# EAGLE design R650C (EAGLE 6.6.0)
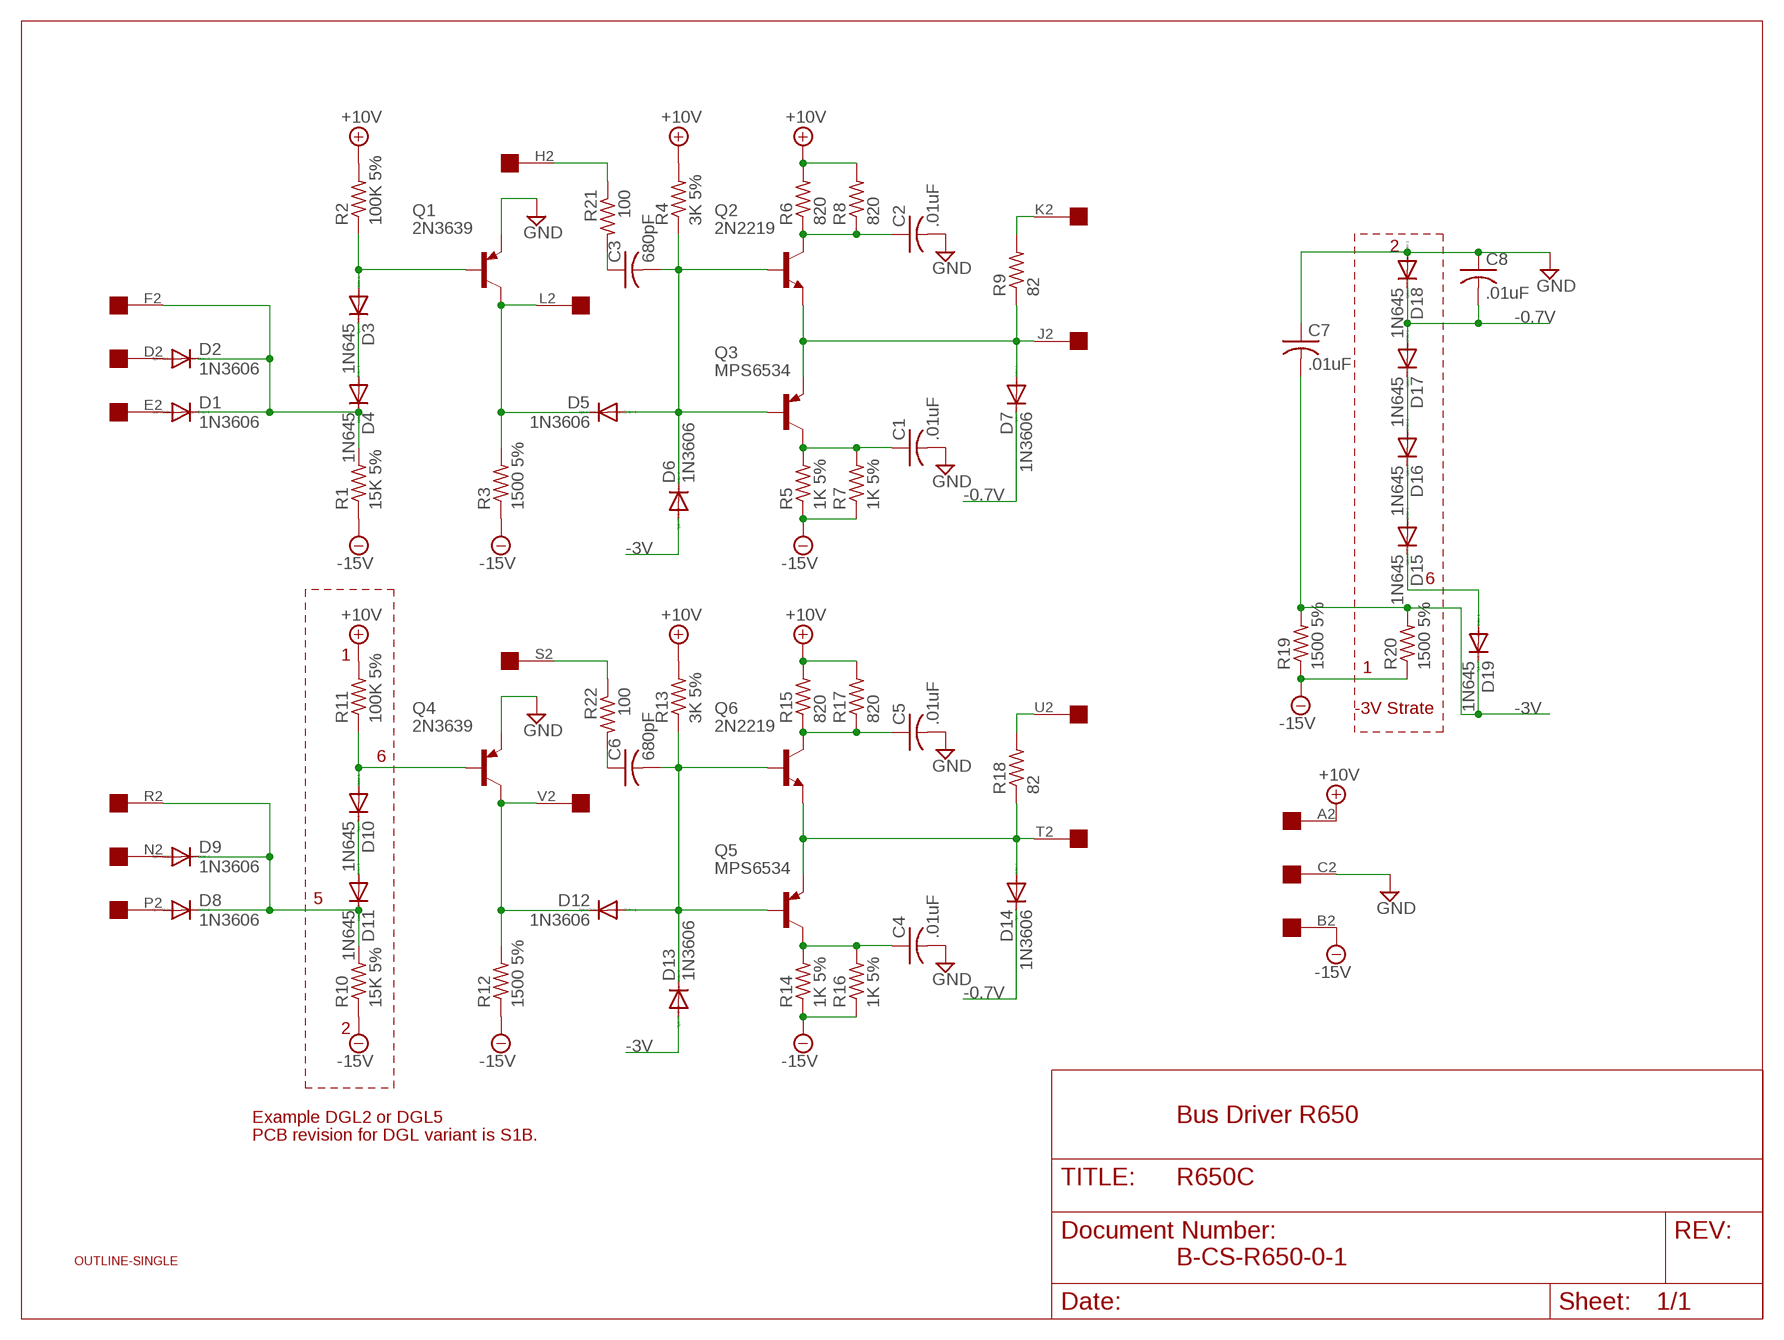
[diagram p0: schematic, sheet 1]

## Parts
C1  .01uF  C-US050-025X075  [C050-025X075]
C2  .01uF  C-US050-025X075  [C050-025X075]
C3  680pF  C-US050-025X075  [C050-025X075]
C4  .01uF  C-US050-025X075  [C050-025X075]
C5  .01uF  C-US050-025X075  [C050-025X075]
C6  680pF  C-US050-025X075  [C050-025X075]
C7  .01uF  C-US050-025X075  [C050-025X075]
C8  .01uF  C-US050-025X075  [C050-025X075]
D1  1N3606  1N4148DO35-10  [DO35-10]
D2  1N3606  1N4148DO35-10  [DO35-10]
D3  1N645  1N4148DO35-10  [DO35-10]
D4  1N645  1N4148DO35-10  [DO35-10]
D5  1N3606  1N4148DO35-10  [DO35-10]
D6  1N3606  1N4148DO35-10  [DO35-10]
D7  1N3606  1N4148DO35-10  [DO35-10]
D8  1N3606  1N4148DO35-10  [DO35-10]
D9  1N3606  1N4148DO35-10  [DO35-10]
D10  1N645  1N4148DO35-10  [DO35-10]
D11  1N645  1N4148DO35-10  [DO35-10]
D12  1N3606  1N4148DO35-10  [DO35-10]
D13  1N3606  1N4148DO35-10  [DO35-10]
D14  1N3606  1N4148DO35-10  [DO35-10]
D15  1N645  1N4148DO35-10  [DO35-10]
D16  1N645  1N4148DO35-10  [DO35-10]
D17  1N645  1N4148DO35-10  [DO35-10]
D18  1N645  1N4148DO35-10  [DO35-10]
D19  1N645  1N4148DO35-10  [DO35-10]
Q1  2N3639  2N3637  [TO39]
Q2  2N2219  [TO5]
Q3  MPS6534  2N3637  [TO39]
Q4  2N3639  2N3637  [TO39]
Q5  MPS6534  2N3637  [TO39]
Q6  2N2219  [TO5]
R1  15K 5%  R-US_0207/10  [0207/10]
R2  100K 5%  R-US_0207/10  [0207/10]
R3  1500 5%  R-US_0207/10  [0207/10]
R4  3K 5%  R-US_0207/10  [0207/10]
R5  1K 5%  R-US_0207/10  [0207/10]
R6  820  R-US_0207/10  [0207/10]
R7  1K 5%  R-US_0207/10  [0207/10]
R8  820  R-US_0207/10  [0207/10]
R9  82  R-US_0207/10  [0207/10]
R10  15K 5%  R-US_0207/10  [0207/10]
R11  100K 5%  R-US_0207/10  [0207/10]
R12  1500 5%  R-US_0207/10  [0207/10]
R13  3K 5%  R-US_0207/10  [0207/10]
R14  1K 5%  R-US_0207/10  [0207/10]
R15  820  R-US_0207/10  [0207/10]
R16  1K 5%  R-US_0207/10  [0207/10]
R17  820  R-US_0207/10  [0207/10]
R18  82  R-US_0207/10  [0207/10]
R19  1500 5%  R-US_0207/10  [0207/10]
R20  1500 5%  R-US_0207/10  [0207/10]
R21  100  R-US_0207/10  [0207/10]
R22  100  R-US_0207/10  [0207/10]
U$1  OUTLINE-SINGLE  [SINGLE]
U$2  EDGE-1  [EDGE-CON1]

## Nets
+10V [Power]: R2.2 R4.2 R6.2 R8.2 R11.2 R13.2 R15.2 R17.2 U$2.A2
-0.7V [Power]: C8.2 D7.C D14.C D17.A D18.C
-3V [Power]: C7.2 D6.A D13.A D19.C R19.2 R20.2
-15V [Power]: R1.1 R3.1 R5.1 R7.1 R10.1 R12.1 R14.1 R16.1 R19.1 R20.1 U$2.B2
GND [Power]: C1.2 C2.2 C4.2 C5.2 C7.1 C8.1 D18.A Q1.1(E) Q4.1(E) U$2.C2
N$1: C3.2 D5.A D6.C Q2.2(B) Q3.2(B) R4.1
N$2: D7.A Q2.1(E) Q3.1(E) R9.1 U$2.J2
N$3: R9.2 U$2.K2
N$4: D12.C Q4.3(C) R12.2 U$2.V2
N$5: D5.C Q1.3(C) R3.2 U$2.L2
N$6: C2.1 Q2.3(C) R6.1 R8.1
N$7: C1.1 Q3.3(C) R5.2 R7.2
N$8: D10.A Q4.2(B) R11.1
N$10: D8.C D9.C D11.C R10.2 U$2.R2
N$11: D10.C D11.A
N$13: D16.A D17.C
N$14: R21.1 U$2.H2
N$15: C3.1 R21.2
N$16: D15.A D16.C
N$17: C6.2 D12.A D13.C Q5.2(B) Q6.2(B) R13.1
N$18: D14.A Q5.1(E) Q6.1(E) R18.1 U$2.T2
N$19: D3.A Q1.2(B) R2.1
N$21: D1.A U$2.E2
N$22: D1.C D2.C D4.C R1.2 U$2.F2
N$23: D3.C D4.A
N$25: C5.1 Q6.3(C) R15.1 R17.1
N$26: C4.1 Q5.3(C) R14.2 R16.2
N$27: R18.2 U$2.U2
N$28: R22.1 U$2.S2
N$29: C6.1 R22.2
N$30: D9.A U$2.N2
N$31: D8.A U$2.P2
N$34: D15.C D19.A
N$39: D2.A U$2.D2
Unconnected: U$2.M2

## Notes on the sheet
- 2
- 6
- 1 | 1
- -3V Strate
- 6
- 5
- 2
- Example DGL2 or DGL5 | Bus Driver R650
- PCB revision for DGL variant is S1B.
- B-CS-R650-0-1

## Library data of the parts
C1-C8 = rcl:C-US: CAPACITOR, American symbol
D1-D19 = diode:1N4148: DIODE high speed (Philips)
Q1 Q3-Q5 = transistor-pnp:2N3637*: PNP Transistror
Q2 Q6 = transistor:2N2219: NPN TRANSISTOR
R1-R22 = rcl:R-US_: RESISTOR, American symbol
U$1 = dec-con:OUTLINE-*: Board outlines for DEC boards.
U$2 = dec-con:EDGE-1: Single-Sided DEC Edge Connector -- (side 2)

## Net classes
1 Power: width 0.813 mm

## Board
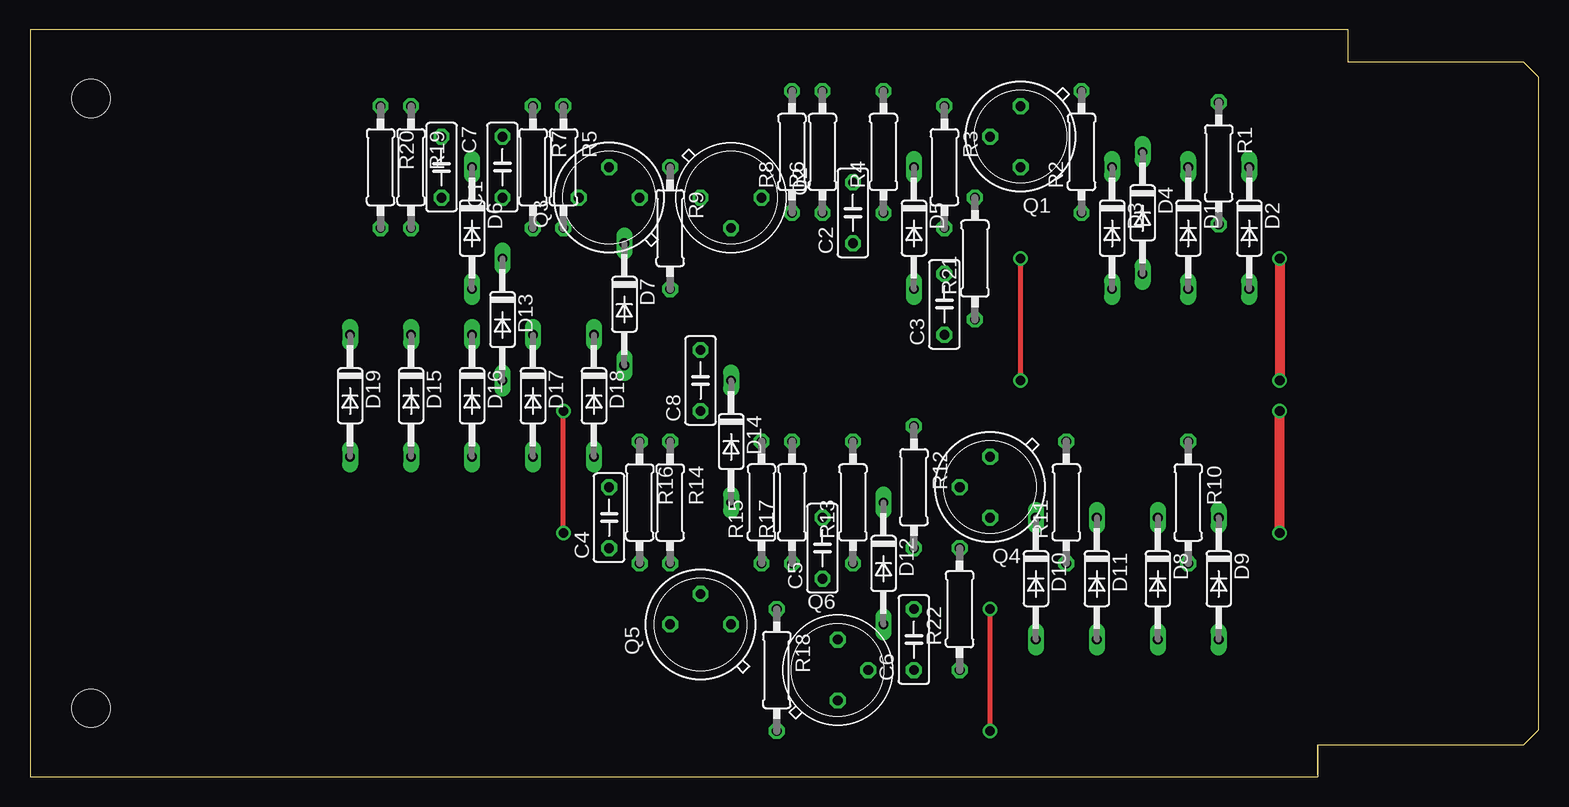
[diagram p1: board, top side]
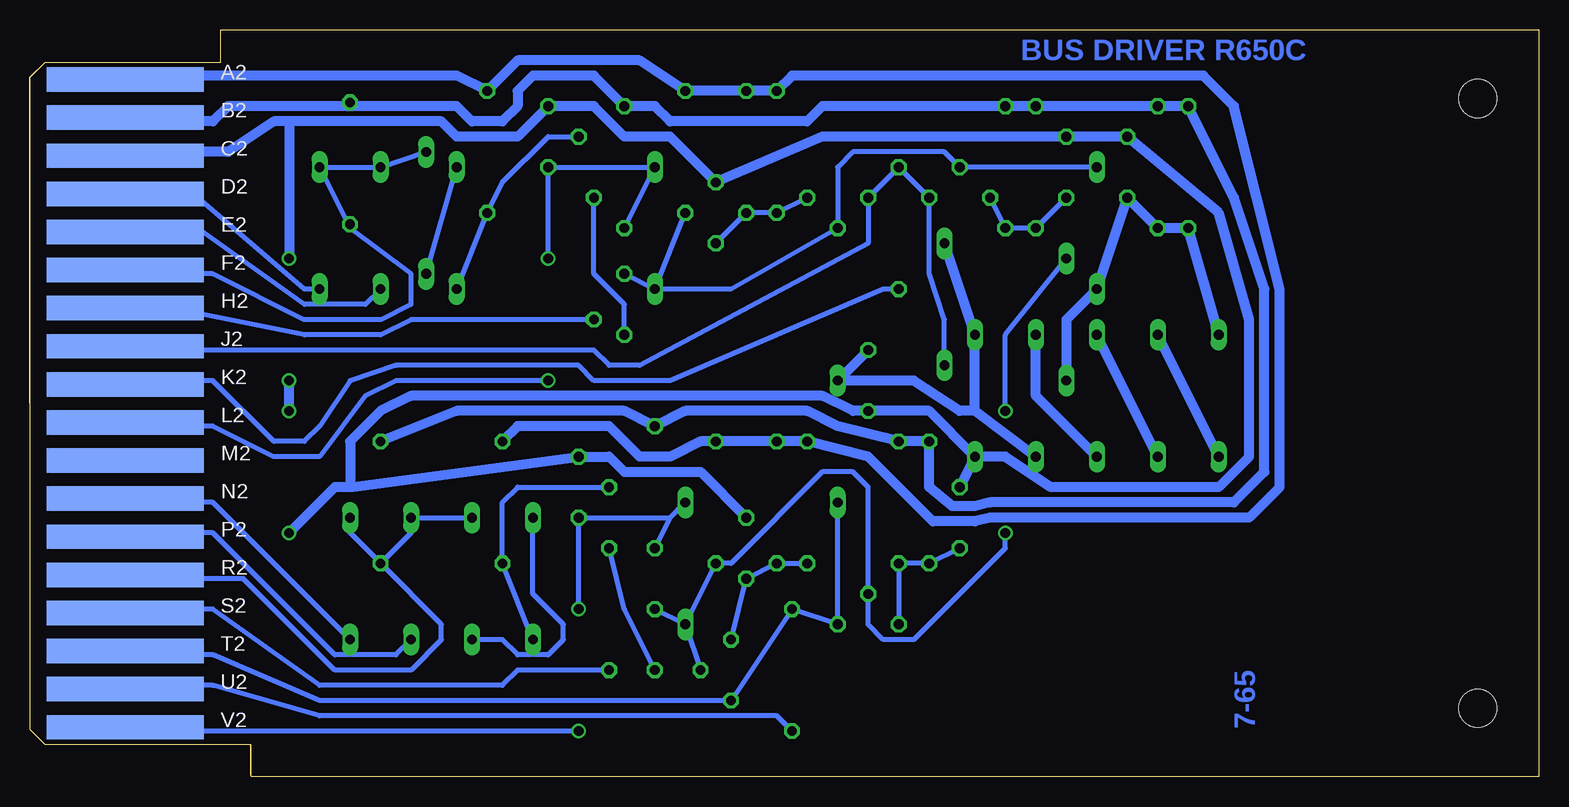
[diagram p2: board, bottom side, seen from below]

Size 125.73 x 62.23 mm. Coordinates in mm from the lower left corner, seen from the top.
Copper layers (1+16): Top 0.035mm / dielectric 1.5mm / Bottom 0.035mm
Design rules "16mils": minimum track width 16mil, minimum drill 32mil, track to track 15mil, track to pad 10mil, pad to pad 10mil, via to via 10mil, smd to smd 10mil, copper to edge 13mil, drill to drill 10mil, minimum pad ring 10mil, minimum via ring 8mil, stop-mask expansion 0mil, vias tented up to drill 0mil, thermal gap 10mil

### Footprints (pad centres in the part's own frame; a part is rotated, then mirrored left to right if it is on the bottom)
C050-025X075 = drill 0.813 octagon: 1 -2.54,0; 2 2.54,0
DO35-10 = drill 0.813 long: A 5.08,0; C -5.08,0
TO39 = drill 0.813 octagon: 1 0,-2.54; 2 2.54,0; 3 0,2.54
TO5 = drill 0.813 octagon: 1 0,-2.54; 2 2.54,0; 3 0,2.54
0207/10 = drill 0.813 octagon: 1 -5.08,0; 2 5.08,0
SINGLE = hole 3.175: 120.65,56.515; 120.65,5.715
EDGE-CON1 = smd 13.106 x 2.032 bottom: A2 7.938,4.128; B2 7.938,7.303; C2 7.938,10.477; D2 7.938,13.652; E2 7.938,16.828; F2 7.938,20.003; H2 7.938,23.177; J2 7.938,26.352; K2 7.938,29.527; L2 7.938,32.703; M2 7.938,35.877; N2 7.938,39.053; P2 7.938,42.227; R2 7.938,45.403; S2 7.938,48.578; T2 7.938,51.752; U2 7.938,54.928; V2 7.938,58.102

### Placement (x,y rotation side)
C1  39.37,50.8 90 top
C2  68.58,46.99 90 top
C3  76.2,39.37 90 top
C4  48.26,21.59 90 top
C5  66.04,19.05 90 top
C6  73.66,11.43 90 top
C7  34.29,50.8 270 top
C8  55.88,33.02 90 top
D1  96.52,45.72 270 top
D2  101.6,45.72 270 top
D3  90.17,45.72 270 top
D4  92.71,46.99 270 top
D5  73.66,45.72 270 top
D6  36.83,45.72 270 top
D7  49.53,39.37 270 top
D8  93.98,16.51 270 top
D9  99.06,16.51 270 top
D10  83.82,16.51 270 top
D11  88.9,16.51 270 top
D12  71.12,17.78 270 top
D13  39.37,38.1 270 top
D14  58.42,27.94 270 top
D15  31.75,31.75 270 top
D16  36.83,31.75 270 top
D17  41.91,31.75 270 top
D18  46.99,31.75 270 top
D19  26.67,31.75 270 top
Q1  82.55,53.34 180 top
Q2  58.42,48.26 270 top
Q3  48.26,48.26 90 top
Q4  80.01,24.13 180 top
Q5  55.88,12.7 90 top
Q6  67.31,8.89 0 top
R1  99.06,51.12 270 top
R2  87.63,52.07 90 top
R3  76.2,50.8 270 top
R4  71.12,52.07 90 top
R5  44.45,50.8 270 top
R6  66.04,52.07 90 top
R7  41.91,50.8 270 top
R8  63.5,52.07 90 top
R9  53.34,45.72 270 top
R10  96.52,22.86 270 top
R11  86.36,22.86 90 top
R12  73.66,24.13 270 top
R13  68.58,22.86 90 top
R14  53.34,22.86 270 top
R15  60.96,22.86 90 top
R16  50.8,22.86 270 top
R17  63.5,22.86 90 top
R18  62.23,8.89 270 top
R19  31.75,50.8 270 top
R20  29.21,50.8 270 top
R21  78.74,43.18 90 top
R22  77.47,13.97 90 top
U$1  125.73,62.23 180 top
U$2  125.73,62.23 180 top

### Tracks (layer width: path | path; a pad name or v marks a point on that pad's centre or on a via)
+10V
  Bottom 0.813: U$2.A2 116.84,58.42 90.17,58.42 R2.2 85.09,59.69 74.93,59.69 R4.2 R6.2 R8.2 62.23,58.42 27.94,58.42 25.4,55.88 21.59,40.64 21.59,24.13 24.13,21.59 45.72,21.59 46.99,21.27 50.48,21.27 55.88,26.67 R15.2 R17.2 R13.2 69.85,27.94 72.39,26.67 74.93,26.67 77.47,29.21 85.09,29.21 R11.2
-0.7V
  Bottom 0.813: D14.C 52.07,33.02 48.26,30.48 46.99,30.48 | D14.C C8.2 | D14.C C8.2 | 46.99,30.48 D18.C D7.C | D17.A 46.99,30.48 | D14.C C8.2
-3V
  Bottom 0.813: D19.C R20.2 R19.2 C7.2 D6.A 39.37,38.1 D13.A
-15V
  Bottom 0.813: U$2.B2 116.84,54.61 110.49,54.61 109.22,55.88 99.06,55.88 | 99.06,55.88 90.17,55.88 88.9,54.61 86.36,54.61 85.09,55.88 85.09,57.15 83.82,58.42 78.74,58.42 R3.1 73.66,55.88 72.39,54.61 60.96,54.61 59.69,55.88 R5.1 R7.1 R19.1 R20.1 25.4,48.26 22.86,40.64 22.86,25.4 25.4,22.86 45.72,22.86 46.99,22.54 48.9,22.54 50.8,24.13 R16.1 R14.1 58.42,29.21 60.96,30.48 71.12,30.48 R12.1 76.2,30.48 90.17,30.48 R10.1 | 99.06,55.88 R1.1
GND  (via drill 0.81)
  Top 0.813: v104.14,20.32 v104.14,30.48 | v104.14,43.18 v104.14,33.02
  Bottom 0.813: 99.06,24.13 Q4.1 77.47,26.67 76.2,25.4 69.85,25.4 C5.2 | 99.06,24.13 100.33,24.13 v104.14,20.32 | v104.14,30.48 v104.14,33.02 | U$2.C2 116.84,52.07 109.22,52.07 105.41,54.61 104.14,54.61 | 104.14,54.61 v104.14,43.18 | 104.14,54.61 91.44,54.61 90.17,53.34 85.09,53.34 Q1.1 78.74,55.88 76.2,53.34 72.39,53.34 C2.2 59.69,53.34 C1.2 C7.1 26.67,46.99 24.13,38.1 24.13,26.67 26.67,24.13 40.64,24.13 44.45,26.67 D18.A | 99.06,24.13 99.06,27.94 96.52,30.48 93.98,31.75 59.69,31.75 57.15,30.48 C8.1 50.8,30.48 D18.A | D18.A C4.2
N$1
  Bottom 0.406: D6.C Q3.2 49.53,52.07 57.15,52.07 58.42,50.8 Q2.2 67.31,40.64 D5.A | D5.A C3.2 | D5.A R4.1
N$2
  Bottom 0.406: U$2.J2 116.84,35.56 78.74,35.56 77.47,34.29 74.93,34.29 55.88,44.45 Q2.1 R9.1 Q3.1 50.8,41.91 49.53,38.1 D7.A
N$3
  Bottom 0.406: U$2.K2 116.84,33.02 110.49,33.02 105.41,27.94 102.87,27.94 101.6,29.21 99.06,33.02 95.25,34.29 80.01,34.29 78.74,33.02 72.39,33.02 54.61,40.64 R9.2
N$4  (via drill 0.81)
  Top 0.406: v80.01,3.81 v80.01,13.97
  Bottom 0.406: U$2.V2 116.84,4.13 116.84,3.81 v80.01,3.81 | v80.01,13.97 Q4.3 72.39,21.59 | 72.39,21.59 R12.2 | 72.39,21.59 D12.C
N$5  (via drill 0.81)
  Top 0.406: v82.55,33.02 v82.55,43.18
  Bottom 0.406: v82.55,43.18 Q1.3 D5.C R3.2 | U$2.L2 116.84,29.21 110.49,29.21 105.41,26.67 101.6,26.67 97.79,31.75 95.25,33.02 v82.55,33.02
N$6
  Bottom 0.406: Q2.3 R8.1 R6.1 C2.1
N$7
  Bottom 0.406: C1.1 R7.2 R5.2 Q3.3
N$8
  Bottom 0.406: Q4.2 85.09,24.13 86.36,22.86 R11.1 D10.A
N$10
  Bottom 0.406: U$2.R2 117.17,16.84 116.84,16.51 107.95,16.51 100.33,8.89 93.98,8.89 91.44,11.43 91.44,12.7 R10.2 | D9.C 99.06,20.32 R10.2 | R10.2 93.98,20.32 D8.C D11.C
N$11
  Bottom 0.406: D10.C 83.82,15.24 81.28,12.7 81.28,11.43 82.55,10.16 85.09,10.16 86.36,11.43 D11.A
N$13
  Bottom 0.813: D16.A 41.91,31.75 D17.C
N$14
  Bottom 0.406: U$2.H2 115.57,39.37 102.87,36.83 96.52,36.83 93.98,38.1 R21.1
N$15
  Bottom 0.406: R21.2 78.74,41.91 76.2,39.37 C3.1
N$16
  Bottom 0.813: D15.A D16.C
N$17  (via drill 0.81)
  Top 0.406: v44.45,20.32 v44.45,30.48
  Bottom 0.406: D12.A R13.1 67.31,17.78 59.69,25.4 57.15,25.4 55.88,24.13 Q5.2 55.88,12.7 54.61,11.43 52.07,11.43 44.45,19.05 v44.45,20.32 | D12.A C6.2 | D12.A Q6.2 | D13.C 44.45,36.83 v44.45,30.48
N$18
  Bottom 0.406: U$2.T2 116.84,10.16 110.49,10.16 101.6,6.35 Q6.1 R18.1 Q5.1 D14.A
N$19
  Bottom 0.406: D3.A R2.1 86.36,49.53 82.55,53.34 Q1.2
N$21
  Bottom 0.406: U$2.E2 116.84,45.72 111.76,45.72 102.87,39.37 97.79,39.37 D1.A
N$22
  Bottom 0.406: D4.C D1.C D2.C 99.06,45.72 | 99.06,45.72 R1.2 | U$2.F2 116.84,41.91 110.49,41.91 102.87,38.1 96.52,38.1 93.98,39.37 93.98,41.91 99.06,45.72
N$23
  Bottom 0.406: D4.A D3.C
N$25
  Bottom 0.406: R15.1 R17.1 C5.1 Q6.3
N$26
  Bottom 0.406: Q5.3 R14.2 R16.2 C4.1
N$27
  Bottom 0.406: U$2.U2 116.84,7.62 110.49,7.62 101.6,5.08 63.5,5.08 R18.2
N$28
  Bottom 0.406: U$2.S2 116.84,13.97 110.49,13.97 101.6,7.62 86.36,7.62 85.09,8.89 R22.1
N$29
  Bottom 0.406: C6.1 76.2,13.97 R22.2
N$30
  Bottom 0.406: U$2.N2 116.84,22.86 110.49,22.86 D9.A
N$31
  Bottom 0.406: U$2.P2 117.17,19.99 116.84,20.32 110.49,20.32 100.33,10.16 95.25,10.16 D8.A
N$34
  Bottom 0.813: D19.A D15.C
N$39
  Bottom 0.406: U$2.D2 116.84,48.26 111.76,48.26 102.87,40.64 D2.A

### Text on the board
Bottom: BUS DRIVER R650C | 7-65